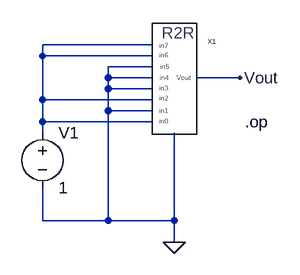
[diagram p0: schematic R2R_test.asc]
R2R_test.asc, the LTspice schematic file:
Version 4
SHEET 1 880 680
WIRE 192 112 32 112
WIRE 32 128 32 112
WIRE 192 128 32 128
WIRE 192 144 128 144
WIRE 128 160 128 144
WIRE 192 160 128 160
WIRE 320 160 256 160
WIRE 128 176 128 160
WIRE 192 176 128 176
WIRE 32 192 32 128
WIRE 192 192 32 192
WIRE 128 208 128 176
WIRE 192 208 128 208
WIRE 32 224 32 192
WIRE 192 224 32 224
WIRE 32 240 32 224
WIRE 32 368 32 320
WIRE 128 368 128 208
WIRE 128 368 32 368
WIRE 224 368 224 240
WIRE 224 368 128 368
WIRE 224 400 224 368
FLAG 320 160 Vout
FLAG 224 400 0
SYMBOL R2R 208 128 R0
SYMATTR InstName X1
SYMBOL voltage 32 224 R0
WINDOW 123 0 0 Left 0
WINDOW 39 0 0 Left 0
SYMATTR InstName V1
SYMATTR Value 1
TEXT 328 224 Left 2 !.op

The netlist it stands for:
* R2R_test.asc
XX1 Vout 0 N001 0 N001 0 0 0 N001 N001 R2R  ; pins Vout VLOW in0 in1 in2 in3 in4 in5 in6 in7
V1 N001 0 1
.op
.backanno
.end